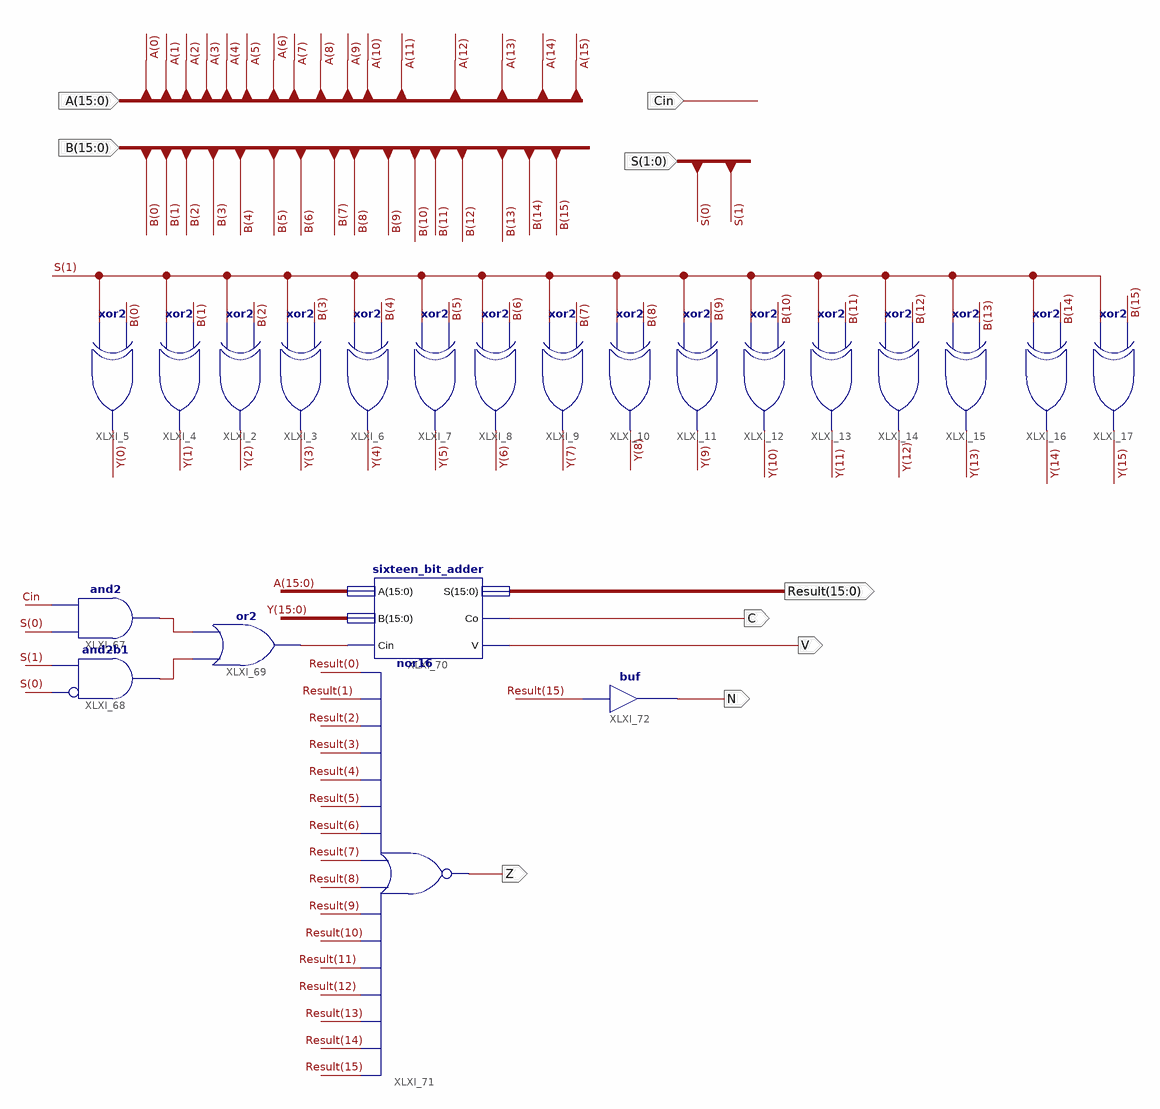
[diagram p0: schematic sheet 1]
// Xilinx ISE schematic ALU_16bit.sch (artix7) as structural Verilog: 22 symbols, 9 ports
module ALU_16bit (
  input  [15:0] A,
  input  [15:0] B,
  input  Cin,
  input  [1:0] S,
  output [15:0] Result,
  output C,
  output V,
  output Z,
  output N
);

  wire or_out, XLXN_9, XLXN_10;
  wire [15:0] Y;

  xor XLXI_2 (Y[2], S[1], B[2]);
  xor XLXI_3 (Y[3], S[1], B[3]);
  xor XLXI_4 (Y[1], S[1], B[1]);
  xor XLXI_6 (Y[4], S[1], B[4]);
  xor XLXI_7 (Y[5], S[1], B[5]);
  xor XLXI_8 (Y[6], S[1], B[6]);
  xor XLXI_9 (Y[7], S[1], B[7]);
  xor XLXI_10 (Y[8], S[1], B[8]);
  xor XLXI_11 (Y[9], S[1], B[9]);
  xor XLXI_12 (Y[10], S[1], B[10]);
  xor XLXI_13 (Y[11], S[1], B[11]);
  xor XLXI_14 (Y[12], S[1], B[12]);
  xor XLXI_15 (Y[13], S[1], B[13]);
  xor XLXI_16 (Y[14], S[1], B[14]);
  xor XLXI_17 (Y[15], S[1], B[15]);
  xor XLXI_5 (Y[0], S[1], B[0]);
  and XLXI_67 (XLXN_9, S[0], Cin);
  and XLXI_68 (XLXN_10, ~S[0], S[1]);  // and2b1
  or XLXI_69 (or_out, XLXN_10, XLXN_9);
  sixteen_bit_adder XLXI_70 (.A(A), .B(Y), .Cin(or_out), .S(Result), .Co(C), .V(V));
  nor XLXI_71 (Z, Result[15], Result[14], Result[13], Result[12], Result[11], Result[10], Result[9], Result[8], Result[7], Result[6], Result[5], Result[4], Result[3], Result[2], Result[1], Result[0]);
  buf XLXI_72 (N, Result[15]);
endmodule
